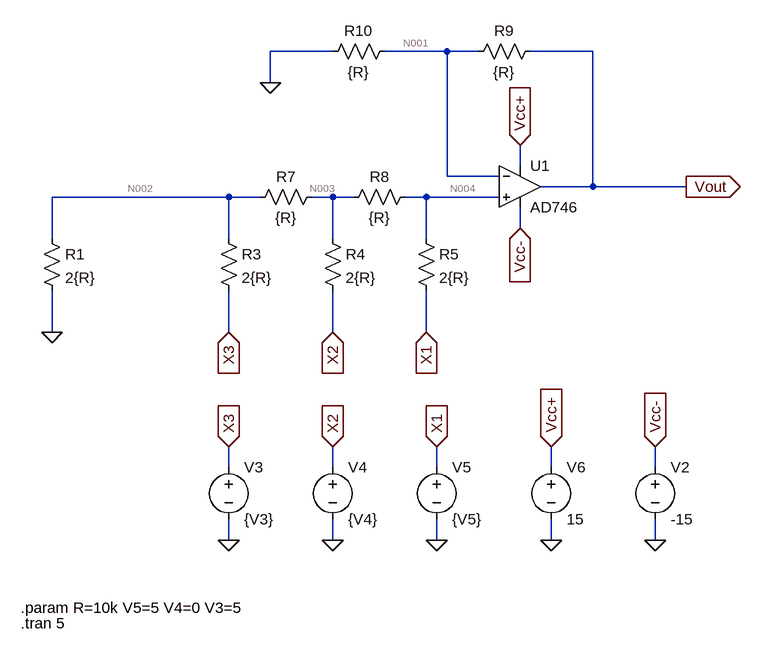
[diagram p0: schematic Task1.asc]
Task1.asc, the LTspice schematic file:
Version 4
SHEET 1 944 736
WIRE 288 -160 192 -160
WIRE 464 -160 368 -160
WIRE 512 -160 464 -160
WIRE 688 -160 592 -160
WIRE 192 -112 192 -160
WIRE 576 16 576 -16
WIRE 464 32 464 -160
WIRE 544 32 464 32
WIRE 688 48 688 -160
WIRE 688 48 608 48
WIRE 832 48 688 48
WIRE 128 64 -144 64
WIRE 176 64 128 64
WIRE 288 64 256 64
WIRE 320 64 288 64
WIRE 432 64 400 64
WIRE 544 64 432 64
WIRE 576 112 576 80
WIRE -144 128 -144 64
WIRE 128 128 128 64
WIRE 288 128 288 64
WIRE 432 128 432 64
WIRE -144 272 -144 208
WIRE 128 272 128 208
WIRE 288 272 288 208
WIRE 432 272 432 208
WIRE 128 480 128 448
WIRE 288 480 288 448
WIRE 448 480 448 448
WIRE 624 480 624 448
WIRE 784 480 784 448
WIRE 128 592 128 560
WIRE 288 592 288 560
WIRE 448 592 448 560
WIRE 624 592 624 560
WIRE 784 592 784 560
FLAG -144 272 0
FLAG 192 -112 0
FLAG 432 272 X1
IOPIN 432 272 In
FLAG 288 272 X2
IOPIN 288 272 In
FLAG 128 272 X3
IOPIN 128 272 In
FLAG 128 448 X3
IOPIN 128 448 In
FLAG 288 448 X2
IOPIN 288 448 In
FLAG 448 448 X1
IOPIN 448 448 In
FLAG 128 592 0
FLAG 288 592 0
FLAG 448 592 0
FLAG 576 112 Vcc-
IOPIN 576 112 In
FLAG 576 -16 Vcc+
IOPIN 576 -16 In
FLAG 624 448 Vcc+
IOPIN 624 448 In
FLAG 784 448 Vcc-
IOPIN 784 448 In
FLAG 624 592 0
FLAG 784 592 0
FLAG 832 48 Vout
IOPIN 832 48 Out
SYMBOL res 112 112 R0
SYMATTR InstName R3
SYMATTR Value 2{R}
SYMBOL res 272 112 R0
SYMATTR InstName R4
SYMATTR Value 2{R}
SYMBOL res 416 112 R0
SYMATTR InstName R5
SYMATTR Value 2{R}
SYMBOL res -160 112 R0
SYMATTR InstName R1
SYMATTR Value 2{R}
SYMBOL res 272 48 R90
WINDOW 0 0 56 VBottom 2
WINDOW 3 32 56 VTop 2
SYMATTR InstName R7
SYMATTR Value {R}
SYMBOL res 416 48 R90
WINDOW 0 0 56 VBottom 2
WINDOW 3 32 56 VTop 2
SYMATTR InstName R8
SYMATTR Value {R}
SYMBOL OpAmps\\AD746 576 -16 R0
SYMATTR InstName U1
SYMBOL res 608 -176 R90
WINDOW 0 0 56 VBottom 2
WINDOW 3 32 56 VTop 2
SYMATTR InstName R9
SYMATTR Value {R}
SYMBOL res 384 -176 R90
WINDOW 0 0 56 VBottom 2
WINDOW 3 32 56 VTop 2
SYMATTR InstName R10
SYMATTR Value {R}
SYMBOL voltage 128 464 R0
SYMATTR InstName V3
SYMATTR Value {V3}
SYMBOL voltage 288 464 R0
SYMATTR InstName V4
SYMATTR Value {V4}
SYMBOL voltage 448 464 R0
SYMATTR InstName V5
SYMATTR Value {V5}
SYMBOL voltage 624 464 R0
SYMATTR InstName V6
SYMATTR Value 15
SYMBOL voltage 784 464 R0
SYMATTR InstName V2
SYMATTR Value -15
TEXT -192 696 Left 2 !.param R=10k V5=5 V4=0 V3=5
TEXT -192 720 Left 2 !.tran 5

The netlist it stands for:
* Task1.asc
R3 N002 X3 2{R}
R4 N003 X2 2{R}
R5 N004 X1 2{R}
R1 N002 0 2{R}
R7 N003 N002 {R}
R8 N004 N003 {R}
XU1 N004 N001 Vcc+ Vcc- Vout AD746  ; pins In+ In- V+ V- OUT
R9 Vout N001 {R}
R10 N001 0 {R}
V3 X3 0 {V3}
V4 X2 0 {V4}
V5 X1 0 {V5}
V6 Vcc+ 0 15
V2 Vcc- 0 -15
.param R=10k V5=5 V4=0 V3=5
.tran 5
.backanno
.end

* Results of the author's LTspice run, read from the files saved beside the schematic
* Operating Point, zero values left out:
*   V(n002) = 2.308 V
*   V(x3) = 5 V
*   V(n003) = 1.923 V
*   V(n004) = 3.462 V
*   V(x1) = 5 V
*   V(n001) = 3.462 V
*   V(vcc+) = 15 V
*   V(vout) = 6.923 V
*   V(vcc-) = -15 V
*   I(R10) = 346.2 µA
*   I(R9) = 346.2 µA
*   I(R8) = 153.8 µA
*   I(R7) = -38.46 µA
*   I(R1) = 230.8 µA
*   I(R5) = -153.8 µA
*   I(R4) = 192.3 µA
*   I(R3) = -269.2 µA
*   I(V2) = 4.771 mA
*   I(V6) = -5.117 mA
*   I(V5) = -153.8 µA
*   I(V4) = 192.3 µA
*   I(V3) = -269.2 µA
*   Ix(u1:1) = 220.8 pA
*   Ix(u1:2) = 220.8 pA
*   Ix(u1:3) = 5.117 mA
*   Ix(u1:4) = -4.771 mA
*   Ix(u1:5) = -346.2 µA